# EAGLE board touch_glove (EAGLE 9.3.1)
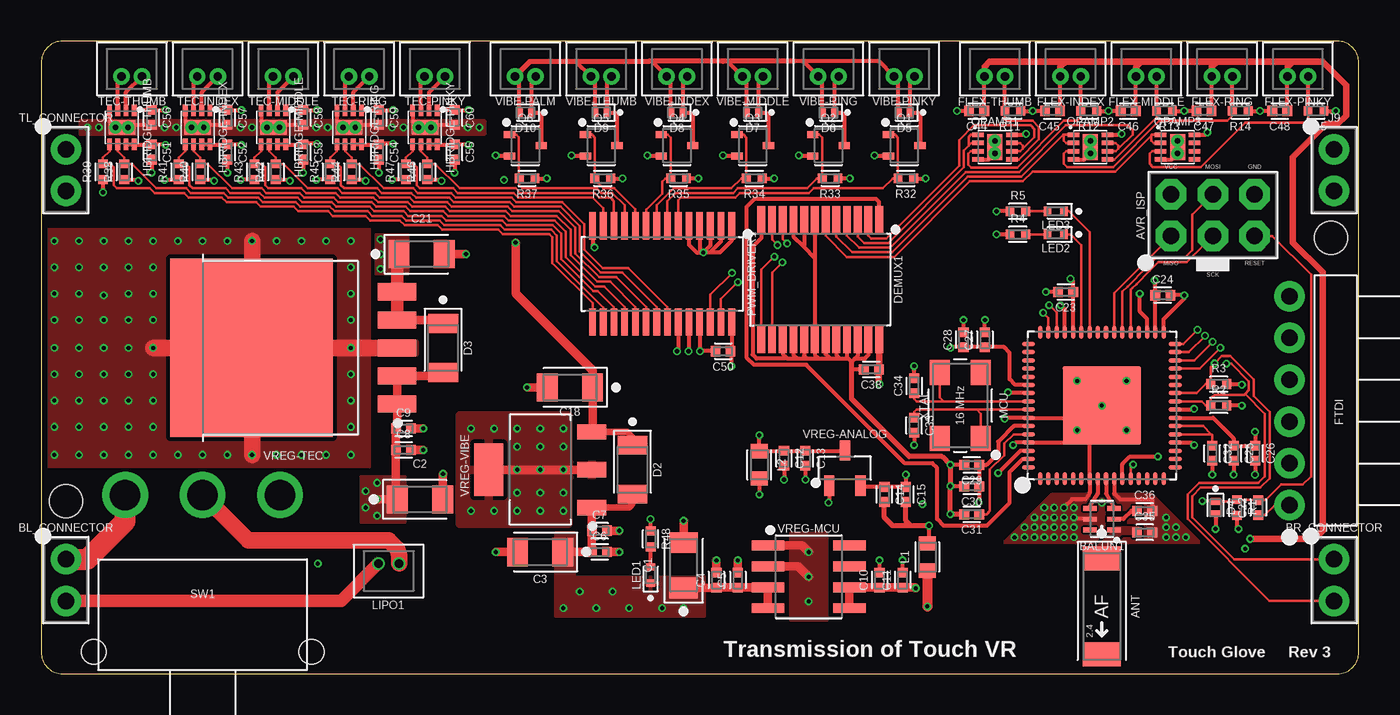
[diagram p5: board, top side]
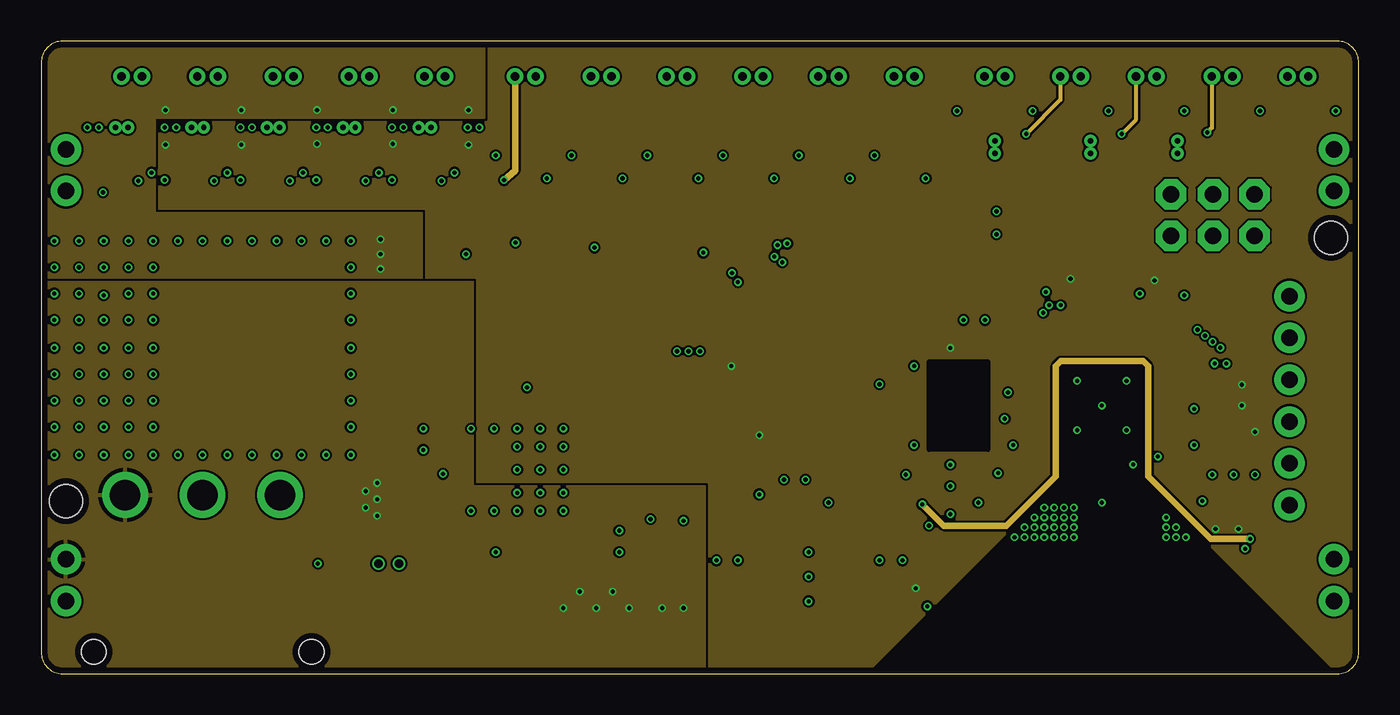
[diagram p6: board, inner layer Route2]
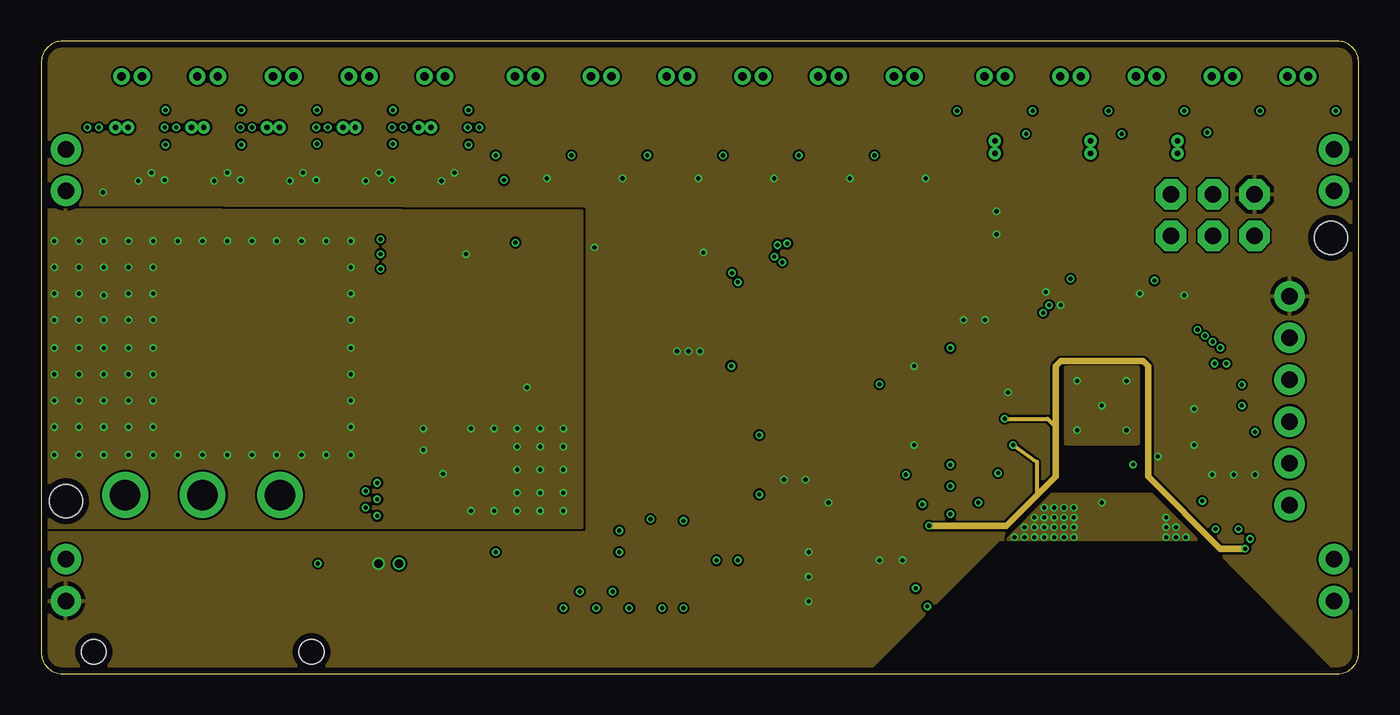
[diagram p7: board, inner layer Route15]
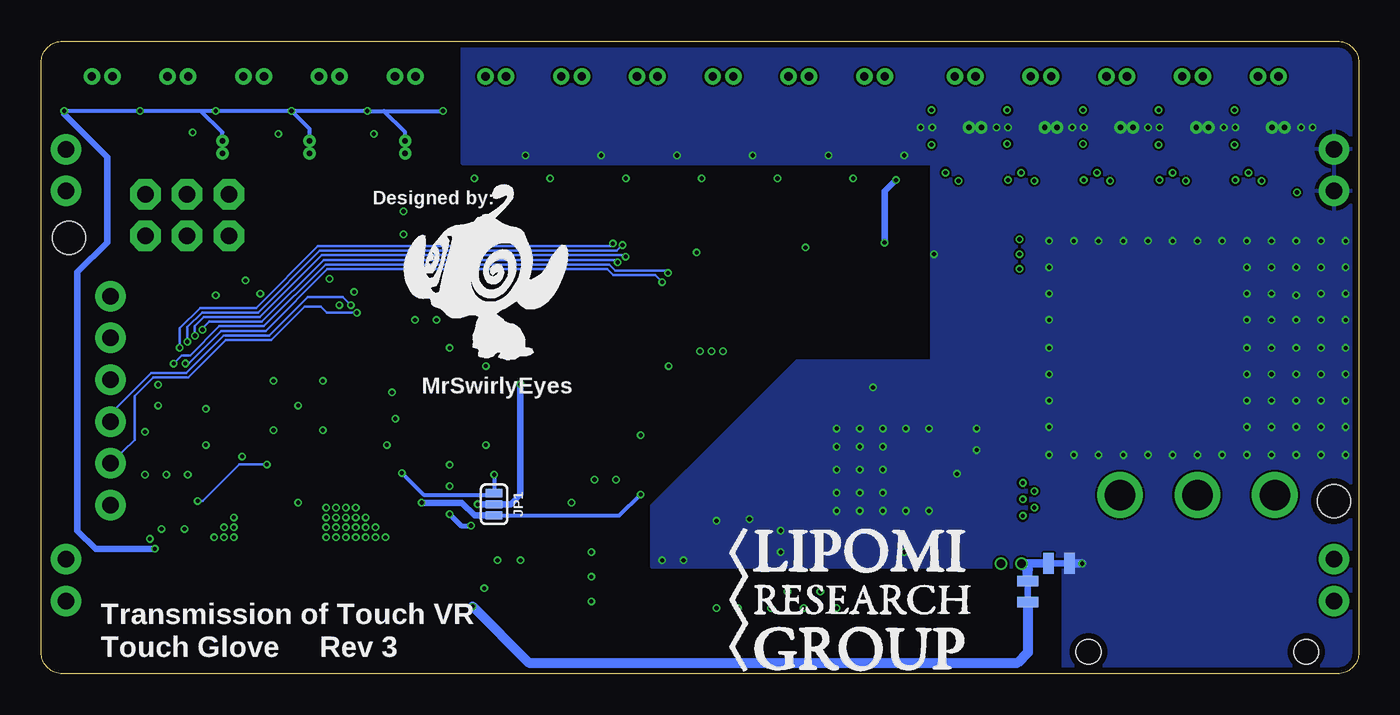
[diagram p8: board, bottom side, seen from below]

Size 80 x 38.44 mm. Coordinates in mm from the lower left corner, seen from the top.
Outline: 78.7,38.44 1.3,38.44 arc90 0,37.14 0,1.3 arc90 1.3,0 78.7,0 arc90 80,1.3 80,37.14 arc90 78.7,38.44
Copper layers (1*2*15*16): Top 0.035559375mm / dielectric 0.17018125mm / Route2 0.01778125mm / dielectric 47mil / Route15 0.01778125mm / dielectric 0.17018125mm / Bottom 0.035559375mm
Design rules "oshpark-4layer": minimum track width 5mil, minimum drill 10mil, track to track 5mil, track to pad 5mil, pad to pad 5mil, via to via 5mil, smd to smd 5mil, copper to edge 15mil, drill to drill 6mil, minimum pad ring 4mil, minimum via ring 4mil, stop-mask expansion 2.5mil, vias tented up to drill 0mil, thermal gap 10mil
Net classes: 1 vcc: width 0.254 mm, drill 0.254 mm, clearance 0.127 mm; 2 RFSIG: width 0.406 mm; 3 ASIG: width 0.254 mm; 4 DGND: width 0.254 mm; 5 NGND: width 0.254 mm
Holes 2 mm at 78.3,26.5 1.5,10.5

## Footprints (pad centres in the part's own frame; a part is rotated, then mirrored left to right if it is on the bottom)
ANTC6522X100 = smd 1.478 x 2.312: 1 -2.917,0 | smd 1.482 x 2.312: 2 2.915,0
HDRV6W64P254_2X3_762X508X838B = drill 1 pad 1.85 octagon: GND 2.54,1.27; MISO -2.54,-1.27; MOSI 0,1.27; RESET 2.54,-1.27; SCK 0,-1.27; VCC -2.54,1.27
RESCAXE65P200X125X95-6 = smd 0.818 x 0.289: 1 -0.73,0.65; 2 -0.73,0; 3 -0.73,-0.65; 4 0.73,-0.65; 5 0.73,0; 6 0.73,0.65
HDRV2W64P254_1X2_508X254X838B = drill 1 pad 1.85: 1 -1.27,0; 2 1.27,0
NET_BRIDGE = smd 0.635 x 1.27: P$1 -0.635,0; P$2 0.635,0
CAPCP3216X160 = smd 1.262 x 1.712: A -1.375,0; K 1.375,0
CAPC1005X55_SMD-0402 = smd 0.585 x 0.612: 1 -0.458,0; 2 0.458,0
SODFL3516X170 = smd 1.136 x 1.815: A -1.489,0; K 1.489,0
DFN100X60X55-2 = smd 0.41 x 0.55: A -0.37,0; K 0.37,0
SOP65P780X200-24 = smd 1.702 x 0.475: 1 -3.603,3.575; 2 -3.603,2.925; 3 -3.603,2.275; 4 -3.603,1.625; 5 -3.603,0.975; 6 -3.603,0.325; 7 -3.603,-0.325; 8 -3.603,-0.975; 9 -3.603,-1.625; 10 -3.603,-2.275; 11 -3.603,-2.925; 12 -3.603,-3.575; 13 3.603,-3.575; 14 3.603,-2.925; 15 3.603,-2.275; 16 3.603,-1.625; 17 3.603,-0.975; 18 3.603,-0.325; 19 3.603,0.325; 20 3.603,0.975; 21 3.603,1.625; 22 3.603,2.275; 23 3.603,2.925; 24 3.603,3.575
_MOLEX-0530470210_VERT_PITCH-1.25MM = drill 0.5 pad 1: 1 -0.625,0; 2 0.625,0
HDRRA6W64P254_1X6_1524X254X254B_FTDI = drill 1 pad 1.85: CTS 3.81,0; DTR -6.35,0; GND 6.35,0; RXI -3.81,0; TXO -1.27,0; VCC 1.27,0
WSON-8-PPAD = smd 0.7 x 0.28: 1 -1.035,0.75; 2 -1.035,0.25; 3 -1.035,-0.25; 4 -1.035,-0.75; 5 1.035,-0.75; 6 1.035,-0.25; 7 1.035,0.25; 8 1.035,0.75 | smd 0.9 x 1.6: GND 0,0 | drill 0.33 pad 0.75: P$1 0,-0.38; P$2 0,0.37
SMT-JUMPER_3_NO_SILK = smd 0.5 x 1: 1 -0.678,0; 2 0,0; 3 0.678,0
INDC1608X60-0603 = smd 0.859 x 1.015: 1 -0.828,0; 2 0.828,0
LEDC1005X40_LED-0402 = smd 0.454 x 0.554: A -0.5,0; K 0.5,0
BATTERY_MOLEX-0530470210_VERT_PITCH-1.25MM = drill 0.5: + -0.625,0; - 0.625,0
QFN50P900X900X90-64 = smd 0.812 x 0.282: 1 -4.45,3.75; 2 -4.45,3.25; 3 -4.45,2.75; 4 -4.45,2.25; 5 -4.45,1.75; 6 -4.45,1.25; 7 -4.45,0.75; 8 -4.45,0.25; 9 -4.45,-0.25; 10 -4.45,-0.75; 11 -4.45,-1.25; 12 -4.45,-1.75; 13 -4.45,-2.25; 14 -4.45,-2.75; 15 -4.45,-3.25; 16 -4.45,-3.75; 33 4.45,-3.75; 34 4.45,-3.25; 35 4.45,-2.75; 36 4.45,-2.25; 37 4.45,-1.75; 38 4.45,-1.25; 39 4.45,-0.75; 40 4.45,-0.25; 41 4.45,0.25; 42 4.45,0.75; 43 4.45,1.25; 44 4.45,1.75; 45 4.45,2.25; 46 4.45,2.75; 47 4.45,3.25; 48 4.45,3.75 | smd 0.282 x 0.812: 17 -3.75,-4.45; 18 -3.25,-4.45; 19 -2.75,-4.45; 20 -2.25,-4.45; 21 -1.75,-4.45; 22 -1.25,-4.45; 23 -0.75,-4.45; 24 -0.25,-4.45; 25 0.25,-4.45; 26 0.75,-4.45; 27 1.25,-4.45; 28 1.75,-4.45; 29 2.25,-4.45; 30 2.75,-4.45; 31 3.25,-4.45; 32 3.75,-4.45; 49 3.75,4.45; 50 3.25,4.45; 51 2.75,4.45; 52 2.25,4.45; 53 1.75,4.45; 54 1.25,4.45; 55 0.75,4.45; 56 0.25,4.45; 57 -0.25,4.45; 58 -0.75,4.45; 59 -1.25,4.45; 60 -1.75,4.45; 61 -2.25,4.45; 62 -2.75,4.45; 63 -3.25,4.45; 64 -3.75,4.45 | smd 4.75 x 4.75: EP 0,0 | drill 0.254: P$1 -1.5,1.5; P$2 1.5,1.5; P$3 1.5,-1.5; P$4 -1.5,-1.5; P$5 0,0
SOP65P650X110-28 = smd 1.659 x 0.407: 1 -2.926,4.225; 2 -2.926,3.575; 3 -2.926,2.925; 4 -2.926,2.275; 5 -2.926,1.625; 6 -2.926,0.975; 7 -2.926,0.325; 8 -2.926,-0.325; 9 -2.926,-0.975; 10 -2.926,-1.625; 11 -2.926,-2.275; 12 -2.926,-2.925; 13 -2.926,-3.575; 14 -2.926,-4.225; 15 2.926,-4.225; 16 2.926,-3.575; 17 2.926,-2.925; 18 2.926,-2.275; 19 2.926,-1.625; 20 2.926,-0.975; 21 2.926,-0.325; 22 2.926,0.325; 23 2.926,0.975; 24 2.926,1.625; 25 2.926,2.275; 26 2.926,2.925; 27 2.926,3.575; 28 2.926,4.225
SOTFL65P209X90-3 = smd 0.685 x 0.437: 1 -0.958,0.65; 2 -0.958,-0.65; 3 0.958,0
RESC1005X35_SMD-0402 = smd 0.535 x 0.6: 1 -0.482,0; 2 0.482,0
SW_SLIDE_SPDT_RA_PTH_12.7L-9.5W = drill 1.85: P 0,7.265; S1 -4.7,7.265; S2 4.7,7.265 | hole 1.5: 6.605,-2.265; -6.605,-2.265
SOT95P237X112-3_SOT-23-3 = smd 1.224 x 0.625: 1 -1.064,0.95; 2 -1.064,-0.95; 3 1.064,0
SOIC127P600X265-8 = smd 1.968 x 0.599: 1 -2.473,1.905; 2 -2.473,0.635; 3 -2.473,-0.635; 4 -2.473,-1.905; 5 2.473,-1.905; 6 2.473,-0.635; 7 2.473,0.635; 8 2.473,1.905
TO170P1363X457-6 = smd 2.333 x 1.048: 1 -6.311,3.404; 2 -6.311,1.702; 3 -6.311,0; 4 -6.311,-1.702; 5 -6.311,-3.404 | smd 9.885 x 10.84: TAB 2.535,0
SOT229P700X180-4 = smd 1.76 x 0.932: 1 -3.125,2.3; 2 -3.125,0; 3 -3.125,-2.3 | smd 1.76 x 3.189: TAB 3.125,0
OSCCC500X320X110_CRYSTAL = smd 1.512 x 1.212: 1 -2,-1.25; 2 2,-1.25; 3 2,1.25; 4 -2,1.25

## Placement (x,y rotation side)
ANT  2.45GHz  [ANTC6522X100]  64.4,4.1 270 top
AVR_ISP  AVR ISP  [HDRV6W64P254_2X3_762X508X838B]  71.14,27.87 0 top
BALUN1  50/100  [RESCAXE65P200X125X95-6]  64.4,9.4 180 top
BL_CONNECTOR  PTH VERT MALE  [HDRV2W64P254_1X2_508X254X838B]  1.5,5.7 270 top
BR_ANALOG  NET_BRIDGE  [NET_BRIDGE]  20.1,5 270 bottom
BR_CONNECTOR  PTH VERT MALE  [HDRV2W64P254_1X2_508X254X838B]  78.5,5.7 270 top
BR_NOISE  NET_BRIDGE  [NET_BRIDGE]  18.2,6.7 180 bottom
C1  100uF/10V  [CAPCP3216X160]  39,6.6 90 top
C2  100uF/10V  [CAPCP3216X160]  23,10.6 0 top
C3  100uF/10V  [CAPCP3216X160]  30.3,7.4 180 top
C4  10uF/6.3V  [CAPC1005X55_SMD-0402]  41,5.7 90 top
C5  0.1uF/50V  [CAPC1005X55_SMD-0402]  42.3,5.7 90 top
C6  10uF/6.3V  [CAPC1005X55_SMD-0402]  33.9,7.4 0 top
C7  0.1uF/50V  [CAPC1005X55_SMD-0402]  33.9,8.7 0 top
C8  10uF/6.3V  [CAPC1005X55_SMD-0402]  22,13.6 0 top
C9  0.1uF/50V  [CAPC1005X55_SMD-0402]  22,14.9 0 top
C10  0.1uF/50V  [CAPC1005X55_SMD-0402]  50.9,5.7 90 top
C11  10uF/6.3V  [CAPC1005X55_SMD-0402]  52.3,5.7 90 top
C12  10uF/6.3V  [CAPC1005X55_SMD-0402]  45.1,13.1 270 top
C13  0.1uF/50V  [CAPC1005X55_SMD-0402]  46.4,13.1 270 top
C14  0.1uF/50V  [CAPC1005X55_SMD-0402]  51.2,10.9 270 top
C15  10uF/6.3V  [CAPC1005X55_SMD-0402]  52.5,10.9 270 top
C18  100uF/10V  [CAPCP3216X160]  32.1,17.4 180 top
C21  100uF/10V  [CAPCP3216X160]  23.1,25.5 0 top
C22  0.1uF/50V  [CAPC1005X55_SMD-0402]  73.9,10.1 90 top
C23  0.1uF/50V  [CAPC1005X55_SMD-0402]  62.2,23.2 180 top
C24  1uF/25V  [CAPC1005X55_SMD-0402]  68.1,23 0 top
C25  0.1uF/50V  [CAPC1005X55_SMD-0402]  72.4,13.4 270 top
C26  1uF/25V  [CAPC1005X55_SMD-0402]  73.7,13.4 270 top
C27  0.1uF/50V  [CAPC1005X55_SMD-0402]  57.3,20.3 90 top
C28  1uF/25V  [CAPC1005X55_SMD-0402]  56,20.3 90 top
C29  1uF/25V  [CAPC1005X55_SMD-0402]  56.5,12.7 180 top
C30  0.1uF/50V  [CAPC1005X55_SMD-0402]  56.5,11.4 180 top
C31  1uF/25V  [CAPC1005X55_SMD-0402]  56.5,9.7 180 top
C32  1uF/25V  [CAPC1005X55_SMD-0402]  71.1,13.4 270 top
C33  12pF/100V  [CAPC1005X55_SMD-0402]  53,15.1 270 top
C34  12pF/100V  [CAPC1005X55_SMD-0402]  53,17.5 90 top
C35  0.75pF/50V  [CAPC1005X55_SMD-0402]  67,8.6 0 top
C36  22pF/100V/0402  [CAPC1005X55_SMD-0402]  67,9.9 0 top
C38  0.1uF/50V  [CAPC1005X55_SMD-0402]  50.4,18.5 180 top
C44  0.1uF/50V  [CAPC1005X55_SMD-0402]  56.8,34.2 180 top
C45  0.1uF/50V  [CAPC1005X55_SMD-0402]  61.4,34.2 180 top
C46  0.1uF/50V  [CAPC1005X55_SMD-0402]  66,34.2 180 top
C47  0.1uF/50V  [CAPC1005X55_SMD-0402]  70.6,34.2 180 top
C48  0.1uF/50V  [CAPC1005X55_SMD-0402]  75.2,34.2 180 top
C50  0.1uF/50V  [CAPC1005X55_SMD-0402]  41.4,19.6 180 top
C51  0.1uF/50V  [CAPC1005X55_SMD-0402]  6.7,31.7 270 top
C52  0.1uF/50V  [CAPC1005X55_SMD-0402]  11.3,31.7 270 top
C53  0.1uF/50V  [CAPC1005X55_SMD-0402]  15.9,31.7 270 top
C54  0.1uF/50V  [CAPC1005X55_SMD-0402]  20.5,31.7 270 top
C55  0.1uF/50V  [CAPC1005X55_SMD-0402]  25.1,31.7 270 top
C56  0.1uF/50V  [CAPC1005X55_SMD-0402]  6.7,33.8 270 top
C57  0.1uF/50V  [CAPC1005X55_SMD-0402]  11.3,33.8 270 top
C58  0.1uF/50V  [CAPC1005X55_SMD-0402]  15.9,33.8 270 top
C59  0.1uF/50V  [CAPC1005X55_SMD-0402]  20.5,33.8 270 top
C60  0.1uF/50V  [CAPC1005X55_SMD-0402]  25.1,33.8 270 top
D2  1A/50V  [SODFL3516X170]  35.9,12.4 270 top
D3  1A/50V  [SODFL3516X170]  24.4,19.8 270 top
D4  150mA/75V  [DFN100X60X55-2]  71.3,10.1 270 top
D5  150mA/75V  [DFN100X60X55-2]  52.4,34.1 180 top
D6  150mA/75V  [DFN100X60X55-2]  47.8,34.1 180 top
D7  150mA/75V  [DFN100X60X55-2]  43.2,34.1 180 top
D8  150mA/75V  [DFN100X60X55-2]  38.6,34.1 180 top
D9  150mA/75V  [DFN100X60X55-2]  34,34.1 180 top
D10  150mA/75V  [DFN100X60X55-2]  29.4,34.1 180 top
DEMUX1  CH16_MUX-DEMUX  [SOP65P780X200-24]  47.3,23.95 270 top
FLEX-INDEX  10K  [_MOLEX-0530470210_VERT_PITCH-1.25MM]  62.5,36.3 0 top
FLEX-MIDDLE  10K  [_MOLEX-0530470210_VERT_PITCH-1.25MM]  67.1,36.3 0 top
FLEX-PINKY  10K  [_MOLEX-0530470210_VERT_PITCH-1.25MM]  76.3,36.3 0 top
FLEX-RING  10K  [_MOLEX-0530470210_VERT_PITCH-1.25MM]  71.7,36.3 0 top
FLEX-THUMB  10K  [_MOLEX-0530470210_VERT_PITCH-1.25MM]  57.9,36.3 0 top
FTDI  PTH RA VERT MALE  [HDRRA6W64P254_1X6_1524X254X254B_FTDI]  75.8,16.6 90 top
HBRIDGE-INDEX  DRV8837C 1A  [WSON-8-PPAD]  9.5,33.2 270 top
HBRIDGE-MIDDLE  DRV8837C 1A  [WSON-8-PPAD]  14.1,33.2 270 top
HBRIDGE-PINKY  DRV8837C 1A  [WSON-8-PPAD]  23.3,33.2 270 top
HBRIDGE-RING  DRV8837C 1A  [WSON-8-PPAD]  18.7,33.2 270 top
HBRIDGE-THUMB  DRV8837C 1A  [WSON-8-PPAD]  4.9,33.2 270 top
J9  PTH VERT MALE  [HDRV2W64P254_1X2_508X254X838B]  78.5,30.6 270 top
JP1  JUMPER_SMD_3-PAD_NO_SILK  [SMT-JUMPER_3_NO_SILK]  52.5,10.3 270 bottom
L1  10uH/380mA  [INDC1608X60-0603]  53.8,7.1 90 top
L2  10uH/380mA  [INDC1608X60-0603]  43.6,12.7 270 top
LED1  BLUE  [LEDC1005X40_LED-0402]  37,6 90 top
LED2  GREEN  [LEDC1005X40_LED-0402]  61.6,26.7 180 top
LED3  RED  [LEDC1005X40_LED-0402]  61.6,28.1 180 top
LIPO1  7.4V  [BATTERY_MOLEX-0530470210_VERT_PITCH-1.25MM]  21.1,6.7 180 top
MCU  ATMEGA128RFA1  [QFN50P900X900X90-64]  64.4,16.3 90 top
OPAMP1  LM358  [WSON-8-PPAD]  57.9,32 0 top
OPAMP2  LM358  [WSON-8-PPAD]  63.7,32 0 top
OPAMP3  LM358  [WSON-8-PPAD]  69,32 0 top
PWM_DRIVER1  PCA9685  [SOP65P650X110-28]  37.7,24.3 270 top
Q1  MCH3474 4A/30V  [SOTFL65P209X90-3]  52.4,32.1 0 top
Q2  MCH3474 4A/30V  [SOTFL65P209X90-3]  47.8,32.1 0 top
Q3  MCH3474 4A/30V  [SOTFL65P209X90-3]  43.2,32.1 0 top
Q4  MCH3474 4A/30V  [SOTFL65P209X90-3]  38.6,32.1 0 top
Q5  MCH3474 4A/30V  [SOTFL65P209X90-3]  34,32.1 0 top
Q6  MCH3474 4A/30V  [SOTFL65P209X90-3]  29.4,32.1 0 top
R1  10K  [RESC1005X35_SMD-0402]  72.6,10.1 270 top
R2  4.7K  [RESC1005X35_SMD-0402]  71.5,16.3 0 top
R3  4.7K  [RESC1005X35_SMD-0402]  71.5,17.6 0 top
R4  1K  [RESC1005X35_SMD-0402]  59.3,26.7 0 top
R5  1K  [RESC1005X35_SMD-0402]  59.3,28.1 0 top
R11  10K  [RESC1005X35_SMD-0402]  59,34.2 180 top
R12  10K  [RESC1005X35_SMD-0402]  63.6,34.2 180 top
R13  10K  [RESC1005X35_SMD-0402]  68.2,34.2 180 top
R14  10K  [RESC1005X35_SMD-0402]  72.8,34.2 180 top
R15  10K  [RESC1005X35_SMD-0402]  77.4,34.2 180 top
R32  10K  [RESC1005X35_SMD-0402]  52.5,30.1 180 top
R33  10K  [RESC1005X35_SMD-0402]  47.9,30.1 180 top
R34  10K  [RESC1005X35_SMD-0402]  43.3,30.1 180 top
R35  10K  [RESC1005X35_SMD-0402]  38.7,30.1 180 top
R36  10K  [RESC1005X35_SMD-0402]  34.1,30.1 180 top
R37  10K  [RESC1005X35_SMD-0402]  29.5,30.1 180 top
R38  10K  [RESC1005X35_SMD-0402]  5.05,30.5 90 top
R39  10K  [RESC1005X35_SMD-0402]  3.75,30.5 90 top
R40  10K  [RESC1005X35_SMD-0402]  9.65,30.5 90 top
R41  10K  [RESC1005X35_SMD-0402]  8.35,30.5 90 top
R42  10K  [RESC1005X35_SMD-0402]  14.25,30.5 90 top
R43  10K  [RESC1005X35_SMD-0402]  12.95,30.5 90 top
R44  10K  [RESC1005X35_SMD-0402]  18.85,30.5 90 top
R45  10K  [RESC1005X35_SMD-0402]  17.55,30.5 90 top
R46  10K  [RESC1005X35_SMD-0402]  23.45,30.5 90 top
R47  10K  [RESC1005X35_SMD-0402]  22.15,30.5 90 top
R48  10K  [RESC1005X35_SMD-0402]  37,8.2 270 top
SW1  4A/28V  [SW_SLIDE_SPDT_RA_PTH_12.7L-9.5W]  9.8,3.6 0 top
TEC-INDEX  PELTIER  [_MOLEX-0530470210_VERT_PITCH-1.25MM]  10.1,36.3 0 top
TEC-MIDDLE  PELTIER  [_MOLEX-0530470210_VERT_PITCH-1.25MM]  14.7,36.3 0 top
TEC-PINKY  PELTIER  [_MOLEX-0530470210_VERT_PITCH-1.25MM]  23.9,36.3 0 top
TEC-RING  PELTIER  [_MOLEX-0530470210_VERT_PITCH-1.25MM]  19.3,36.3 0 top
TEC-THUMB  PELTIER  [_MOLEX-0530470210_VERT_PITCH-1.25MM]  5.5,36.3 0 top
TL_CONNECTOR  PTH VERT MALE  [HDRV2W64P254_1X2_508X254X838B]  1.5,30.6 270 top
U$1  [LRG-LOGO-2]  30.9,4.5 0 bottom
U$2  [MRSWIRLYEYES-LOGO]  53,24.4 0 bottom
VIBE-INDEX  Molex VERT 1.25mm pitch  [_MOLEX-0530470210_VERT_PITCH-1.25MM]  38.6,36.3 0 top
VIBE-MIDDLE  Molex VERT 1.25mm pitch  [_MOLEX-0530470210_VERT_PITCH-1.25MM]  43.2,36.3 0 top
VIBE-PALM  Molex VERT 1.25mm pitch  [_MOLEX-0530470210_VERT_PITCH-1.25MM]  29.4,36.3 0 top
VIBE-PINKY  Molex VERT 1.25mm pitch  [_MOLEX-0530470210_VERT_PITCH-1.25MM]  52.4,36.3 0 top
VIBE-RING  Molex VERT 1.25mm pitch  [_MOLEX-0530470210_VERT_PITCH-1.25MM]  47.8,36.3 0 top
VIBE-THUMB  Molex VERT 1.25mm pitch  [_MOLEX-0530470210_VERT_PITCH-1.25MM]  34,36.3 0 top
VREG-ANALOG  MCP1700-1802 1.8V/200mA  [SOT95P237X112-3_SOT-23-3]  48.8,12.5 90 top
VREG-MCU  TPS76833QDR 1A/3.3V  [SOIC127P600X265-8]  46.6,5.9 0 top
VREG-TEC  3A/1.8V  [TO170P1363X457-6]  15.3,19.8 180 top
VREG-VIBE  TL1963A-33 1.5A/3.3V  [SOT229P700X180-4]  30.3,12.4 180 top
XTAL  16 MHz  [OSCCC500X320X110_CRYSTAL]  55.8,16.3 90 top

## Tracks (layer width: path | path; a pad name or v marks a point on that pad's centre or on a via)
1.8V  (via drill 0.25)
  Top 0.152: C60.1 24.98,34.23 | 14.87,34.26 HBRIDGE-MIDDLE.1 | 10.27,34.26 HBRIDGE-INDEX.1 | 5.67,34.26 HBRIDGE-THUMB.1 | 24.19,21.5 D3.A
  Top 0.254: 24.98,34.23 HBRIDGE-PINKY.1 | 14.87,34.26 C58.1 v16.74,34.26 v16.75,34.25 | 10.27,34.26 C57.1 v12.14,34.26 v12.15,34.25 | 5.67,34.26 C56.1 v7.54,34.26 v7.55,34.25 | v21.35,34.25 v21.34,34.26 C59.1 20.48,34.23 HBRIDGE-RING.1 | C60.1 v25.94,34.26 v25.95,34.25
  Top 0.508: VREG-TEC.4 24.19,21.5 | 21.61,25.39 C21.A
  Top 0.762: VREG-TEC.4 VREG-TEC.5 21.61,25.39
  other vias: 20.6,26.4 20.6,25.5 20.6,24.6
  pour Route2 (rank 5): 26.9,38.4 0,38.4 0,24 23.1,24 23.1,28 6.9,28 6.9,33.8 26.9,33.8
  pour Top: 22.3,24.3 20.3,24.3 20.3,26.7 22.3,26.7
3.3V  (via drill 0.25)
  Top 0.254: D5.K 52.03,36.05 VIBE-PINKY.1 50.87,37.21 46.27,37.21 | D6.K 47.43,36.05 VIBE-RING.1 46.27,37.21 | D7.K 42.83,36.05 VIBE-MIDDLE.1 41.67,37.21 41.4,37.21 | D8.K 38.23,36.05 VIBE-INDEX.1 37.07,37.21 36.9,37.21 | D9.K 33.63,36.05 VIBE-THUMB.1 32.5,37.17 32.5,37.21 | D10.K 29.03,36.05 VIBE-PALM.1 | 46.27,37.21 45.67,37.21
  Top 0.305: 45.67,37.21 41.4,37.21 36.9,37.21 32.5,37.21 29.68,37.21 VIBE-PALM.1
  Top 0.406: VREG-VIBE.3 35.59,14.7 35.9,14.39 D2.A
  Top 0.508: VREG-VIBE.3 33.48,14.75 C18.A 33.48,18.43 28.8,23.1 v28.8,26.2
  Route2 0.406: VIBE-PALM.1 28.77,30.57 v28.1,30
  Bottom 0.406: v28.8,26.2 28.77,26.23 28.77,29.32 v28.1,30
+
  Top 1.016: LIPO1.+ 21.73,7.19 21.62,7.58 21.1,8.1 12.57,8.1 SW1.P
A1.8V  (via drill 0.25)
  Top 0.254: VREG-ANALOG.2 49.87,11.36 C14.1 C15.1 v52.5,12.1 | MCU.62 59.45,13.55 v58.1,12.2
  Bottom 0.254: v52.5,12.1 JP1.1 52.59,10.88 56.78,10.88 v58.1,12.2
A3.3V  (via drill 0.25)
  Top 0.254: MCU.59 59.05,15.05 58.1,14.1 58.1,13.4 57.4,12.7 C29.1 C30.1 56.96,10.46 v56.9,10.4 | L2.2 v43.6,10.9
  Bottom 0.254: JP1.3 44.91,9.62 v43.6,10.9
  Bottom 0.406: v56.9,10.4 54.45,10.4 53.67,9.62 JP1.3
AGND  (via drill 0.25)
  Top 0.254: C48.2 v74,34.2 R14.1 | C47.2 v69.4,34.2 R13.1 | R12.1 v64.8,34.2 C46.2 | R11.1 v60.2,34.2 C45.2 | C30.2 v55.2,11.4 | C29.2 v55.2,12.7 | v59.01,13.9 59.16,14.05 MCU.61 62.15,14.05 MCU.P$1 | DEMUX1.15 45.02,19.43 45.3,19.15 | 45.3,19.15 45.9,19.15 | 46.5,19.15 47.2,19.15 | 47.2,19.15 47.9,19.15 | 47.9,19.15 48.5,19.15 | 47.2,19.15 46.98,19.38 DEMUX1.18 46.98,25.27 | DEMUX1.19 47.62,19.43 47.9,19.15 | DEMUX1.20 48.27,19.38 48.5,19.15 | R15.1 v78.6,34.2 | 48.5,19.15 49,19.15 | 49,19.15 49.2,18.95 49.38,19.12 | DEMUX1.21 48.92,19.23 49,19.15 | DEMUX1.17 46.33,19.32 46.5,19.15 | DEMUX1.16 45.67,19.38 45.9,19.15 | v53.9,9 53.9,8.03 L1.2 | DEMUX1.12 43.73,26.48 43.2,25.95 43.2,19.39 43.44,19.15 45.3,19.15 | BALUN1.5 62.7,9.4 v62.7,9.5 | MCU.P$1 63.65,14.05 MCU.7 63.65,11.01 63.4,10.6 62.6,10.6 v62.1,10.1 | MCU.P$1 62.15,15.55 MCU.58 58.55,15.55 v58.5,15.5 | C44.2 v55.6,34.2 | MCU.10 65.15,10.95 65.5,10.6 67.46,10.6 C36.2 | OPAMP3.4 68.63,31.25 OPAMP3.P$1 OPAMP3.GND OPAMP3.P$2 | OPAMP1.4 57.53,31.25 OPAMP1.P$1 OPAMP1.GND OPAMP1.P$2 | OPAMP2.4 63.33,31.25 OPAMP2.P$1 OPAMP2.GND OPAMP2.P$2 | 45.9,19.15 46.5,19.15 | DEMUX1.9 45.67,26.57 46.27,25.98 | 46.27,25.98 46.98,25.27 | DEMUX1.7 46.98,25.27 | DEMUX1.8 46.33,26.02 46.27,25.98 | DEMUX1.22 49.58,19.32 49.38,19.12 | DEMUX1.23 50.23,19.38 49.98,19.12 49.38,19.12 | C38.2 49.3,18.5 49.2,18.4
  Top 0.305: 49.2,18.95 49.2,18.4 49.2,16.7 52.7,13.2 54.7,13.2 v55.2,12.7 v55.2,11.4 v55.2,9.7 C31.2 | v53.9,9 52.8,9 | 52.8,9 52.5,9.3 C15.2 | 52.8,9 51.7,9 51.2,9.5 C14.2
  Route15 0.254: v59.01,13.9 60.45,12.88 60.45,10.85 | 61.6,15 61.1,15.5 v58.5,15.5
  Route15 0.41: v53.9,9 58.6,9 60.45,10.85 61.6,12 61.6,15 61.6,18.7 61.9,19 66.9,19 67.2,18.7 67.2,12 71.6,7.6 v73.1,7.6
  Bottom 0.254: 59.2,34.2 v60.2,34.2 v64.8,34.2 | 59.2,34.2 v55.6,34.2 | v64.8,34.2 v69.4,34.2 70.3,34.2 | 70.3,34.2 v74,34.2 v78.6,34.2 | OPAMP3.P$2 69,32.9 70.3,34.2 | OPAMP2.P$2 63.7,33.1 v64.8,34.2 | 59.2,34.2 57.9,32.9 OPAMP1.P$2
  Bottom 0.305: v55.2,9.7 54.5,9 v53.9,9
  Bottom 0.406: v73.1,7.6 76.7,7.6 77.8,8.7 77.8,24.4 76,26.2 76,31.4 78.6,34 v78.6,34.2
  other vias: 62.7,8.3 62.1,8.3 62.7,8.9 61.5,8.3 60.9,8.3 60.3,8.3 59.7,8.3 62.1,8.9 61.5,8.9 60.9,8.9 60.3,8.9 62.1,9.5 61.5,9.5 60.9,9.5 62.7,10.1 61.5,10.1 64.4,10.4 68.3,8.3 68.9,8.3 68.3,8.9 59.1,8.3 59.7,8.9 60.3,9.5 60.9,10.1 69.5,8.3 68.9,8.9 68.3,9.5
  pour Route15: 62.2,14 66.6,14 66.6,18.6 62.2,18.6
  pour Route15: 58.5,8 61.4,10.9 67.4,10.9 70.3,8
  pour Top (rank 2): 58.5,8 61.4,10.9 67.4,10.9 70.3,8
FLEX-INDEX
  Top 0.152: OPAMP1.1 56.45,32.75 56.31,32.61 56.31,32.09 | DEMUX1.3 49.58,26.57 49.98,26.17 51.42,26.17 56.02,30.77 56.02,31.8 56.31,32.09 | OPAMP1.2 56.47,32.25 56.31,32.09
FLEX-MIDDLE
  Top 0.152: OPAMP2.7 65.25,32.25 65.4,32.1 65.4,31.9 | 65.4,31.9 65.25,31.75 OPAMP2.6 | 65.4,31.9 66.26,32.76 66.26,33.04 65.98,33.32 62.22,33.32 59.38,30.48 56.14,30.48 51.55,25.89 49.66,25.89 48.92,26.62 DEMUX1.4
FLEX-PINKY
  Top 0.152: DEMUX1.6 47.62,26.62 48.92,25.33 51.8,25.33 56.39,29.92 59.61,29.92 60.21,30.52 65.21,30.52 67.39,32.7 | OPAMP3.2 67.55,32.25 67.39,32.41 67.39,32.7 | OPAMP3.1 67.44,32.75 67.39,32.7
FLEX-RING
  Top 0.152: DEMUX1.5 48.27,26.57 49.24,25.61 51.66,25.61 56.25,30.2 59.49,30.2 62.04,32.75 62.1,32.75 | OPAMP2.2 62.25,32.25 62.1,32.4 62.1,32.75 | OPAMP2.1 62.1,32.75
FLEX-THUMB
  Top 0.152: OPAMP1.7 59.45,32.25 59.6,32.1 59.6,31.9 | 59.6,31.9 59.45,31.75 OPAMP1.6 | 59.6,31.9 60.3,32.6 60.3,33.1 60.08,33.32 56.62,33.32 55.74,32.44 55.74,30.89 51.3,26.45 50.4,26.45 50.23,26.62 DEMUX1.2
GND  (via drill 0.25)
  Top 0.254: C34.2 v53,18.7 | C33.2 v53,13.9 | C28.2 v56,21.5 | C27.2 v57.3,21.5 | C10.2 v50.9,6.9 | C11.2 v52.3,6.9 | MCU.11 65.65,12.75 66.1,13.2 v67.8,13.2 | C50.2 v40,19.6 39.98,19.62 PWM_DRIVER1.25 | PWM_DRIVER1.23 38.67,19.68 v38.6,19.6 | PWM_DRIVER1.24 39.33,19.62 v39.3,19.6 | PWM_DRIVER1.3 40.62,26.02 v40.2,25.6 | PWM_DRIVER1.2 41.27,26.27 40.6,25.6 | 40.6,25.6 v40.2,25.6 | PWM_DRIVER1.1 41.92,26.32 41.2,25.6 40.6,25.6 | PWM_DRIVER1.4 39.98,25.6 | 39.98,25.6 v40.2,25.6 | PWM_DRIVER1.5 39.33,26.07 39.8,25.6 39.98,25.6 | R32.1 v53.7,30.1 | C55.2 v25.1,30.45 | C54.2 v20.5,30.45 | C53.2 v15.9,30.45 | C52.2 v11.3,30.45 | C51.2 v6.7,30.45 | PWM_DRIVER1.14 33.48,26.02 v33.6,25.9 | C32.2 v71.1,12.1 | C25.2 v72.4,12.1 | C26.2 v73.7,12.1 | C23.2 v61,23.2 | R4.1 v58,26.7 | R5.1 v58,28.1 | C24.2 v69.4,23 69.4,22.8 68.15,21.55 MCU.33 | MCU.45 62.15,22.15 v61.9,22.4 | MCU.35 67.15,21.55 66.7,22 v66.7,23.1 | MCU.55 58.75,17.05 v58.7,17.1 | MCU.20 69.85,14.05 v70,13.9 | MCU.24 69.95,16.05 v70,16.1 | R37.1 v30.7,30.1 | R36.1 v35.3,30.1 | R34.1 v44.5,30.1 | R46.1 24.23,30.02 v24.3,29.95 | R47.1 21.32,30.02 v21.3,30 | R44.1 19.58,30.02 v19.7,29.95 | R45.1 16.72,30.02 v16.7,30 | R42.1 15.03,30.02 v15.1,29.95 | R43.1 12.12,30.02 v12.1,30 | R41.1 8.33,30 v7.5,30 | R39.1 v3.75,29.25 | R38.1 5.83,30.02 v5.9,29.95 | v49.1,30.1 R33.1 | v39.9,30.1 R35.1 | R40.1 10.43,30.02 v10.5,29.95 | C13.2 v46.4,11.8 | C12.2 v45.1,11.8 | VREG-ANALOG.1 47.85,10.45 v47.8,10.4
  Top 0.508: v46.6,5.9 45.97,6.54 VREG-MCU.2 | v46.6,7.4 46.2,7.8 VREG-MCU.1
  Top 0.762: BL_CONNECTOR.2 18.2,4.43 LIPO1.-
  Bottom 0.508: BR_NOISE.P$2 LIPO1.-
  Bottom 0.61: BR_ANALOG.P$1 20.1,6.33 LIPO1.-
  other vias: 46.6,4.4
  pour Route15 (rank 6): 0,38.44 0,0 80,0 80,38.44
  pour Top: 45.5,3.3 47.7,3.3 47.7,8.5 45.5,8.5
LED_RX
  Top 0.152: LED3.A 62.4,28.1 63.65,26.85 MCU.42
LED_TX
  Top 0.152: LED2.A 62.5,26.7 63.15,26.05 63.15,22.81 MCU.43
MISO
  Top 0.152: AVR_ISP.MISO 65.15,23.15 MCU.39
MOSI
  Top 0.152: MCU.38 65.65,23.23 65.96,23.54 67.11,24.7 67.71,25.3 | 67.71,25.3 | 67.71,25.3 69.44,25.3 69.9,25.75 69.9,27.9 AVR_ISP.MOSI
N$1
  Top 0.254: HBRIDGE-THUMB.3 4.65,36.08 TEC-THUMB.1
N$2
  Top 0.254: VIBE-INDEX.2 38.97,36.05 D8.A 39.4,34.1 39.56,33.94 Q4.3
N$3
  Top 0.254: VIBE-THUMB.2 34.37,36.05 D9.A 34.8,34.1 34.96,33.94 Q5.3
N$4
  Top 0.254: VIBE-MIDDLE.2 43.57,36.05 D7.A 44,34.1 44.16,33.94 Q3.3
N$5
  Top 0.254: HBRIDGE-THUMB.2 5.15,35.33 TEC-THUMB.2
N$6
  Top 0.254: HBRIDGE-INDEX.2 9.75,35.33 TEC-INDEX.2
N$11
  Top 0.254: HBRIDGE-INDEX.3 9.25,36.08 TEC-INDEX.1
N$12
  Top 0.254: HBRIDGE-MIDDLE.3 13.85,36.08 TEC-MIDDLE.1
N$15
  Top 0.254: VIBE-RING.2 48.17,36.05 D6.A 48.6,34.1 48.76,33.94 Q2.3
N$16
  Top 0.254: HBRIDGE-MIDDLE.2 14.35,35.33 TEC-MIDDLE.2
N$17
  Top 0.254: VIBE-PINKY.2 52.77,36.05 D5.A 53.2,34.1 53.36,33.94 Q1.3
N$18
  Top 0.254: HBRIDGE-RING.3 18.45,36.08 TEC-RING.1
N$23
  Top 0.254: HBRIDGE-RING.2 18.95,35.33 TEC-RING.2
N$24
  Top 0.254: HBRIDGE-PINKY.3 23.05,36.08 TEC-PINKY.1
N$27
  Top 0.254: HBRIDGE-PINKY.2 23.55,35.33 TEC-PINKY.2
N$30
  Top 0.254: VIBE-PALM.2 29.77,36.05 D10.A 30.2,34.1 30.36,33.94 Q6.3
N$34
  cutout Route15: 58.2,8 70.7,8 78.6,0 50.2,0
  cutout Route2: 62.2,12 66.6,12 78.6,0 50.2,0
N$35
  Top 0.152: MCU.56 54.8,16.55 | C34.1 53,16.7 53.15,16.55 54.8,16.55 | XTAL.3 54.55,16.8 54.8,16.55
N$36
  Top 0.152: MCU.57 56.8,16.05 | XTAL.1 57.05,15.8 56.8,16.05 | C33.1 53,15.9 53.15,16.05 56.8,16.05
N$37
  cutout Route2: 57.5,19 57.5,13.6 53.9,13.6 53.9,19
N$38
  Top 0.152: FLEX-INDEX.2 | R12.2 63.12,33.82 62.9,33.6 62.1,33.6 59.26,30.76 56.47,30.76 56.3,30.93 56.3,31.6 56.45,31.75 OPAMP1.3
  Top 0.254: R12.2 FLEX-INDEX.2
N$40  (via drill 0.25)
  Top 0.606: L1.1 v53.8,4.1
  Bottom 0.606: v53.8,4.1 50.39,0.69 20.71,0.69 20.1,1.3
  Bottom 0.61: BR_ANALOG.P$2 20.1,1.3
N$41
  Top 0.152: 72.32,36.29 FLEX-RING.2 | R14.2 72.32,33.92 72,33.6 67.89,33.6 65.09,30.8 62.3,30.8 62.1,31 62.1,31.6 62.25,31.75 OPAMP2.3
  Top 0.254: R14.2 72.32,36.29
N$45
  Top 0.254: MCU.9 64.65,10.95 65.13,10.17 BALUN1.3
N$46
  Top 0.254: MCU.8 64.15,10.95 63.67,10.17 BALUN1.4
N$47
  Top 0.254: BALUN1.2 65.7,9.4 66.2,9.9 C36.1
N$50
  Top 0.152: FTDI.DTR 74.87,10.21 74.3,9.64 C22.1
N$53
  Top 0.254: LED1.K R48.2
N$54
  Top 0.152: LED2.K R4.2
N$55
  Top 0.152: LED3.K R5.2
N$62
  Top 0.152: C32.1 71.1,14.5 71.05,14.55 | MCU.22 70.55,15.05 71.05,14.55 | 71.05,14.55 MCU.21
N$63
  Top 0.152: MCU.60 59.05,14.55 58.48,13.98 58.48,13.28 57.6,12.4 57.6,9.9 57.4,9.7 C31.1
N$991
  Top 0.152: 67.72,36.29 FLEX-MIDDLE.2 | OPAMP2.5 65.14,31.25 67.72,33.82 R13.2
  Top 0.254: R13.2 67.72,36.29
N$1004
  Top 0.152: FLEX-THUMB.2 | R11.2 58.52,33.68 58.6,33.6 60.2,33.6 60.58,33.22 60.58,32.48 59.34,31.25 OPAMP1.5
  Top 0.254: R11.2 FLEX-THUMB.2
N$10001
  Top 0.152: FLEX-PINKY.2 | R15.2 76.92,33.62 76.8,33.5 73.1,33.5 70.4,30.8 67.5,30.8 67.3,31 67.3,31.6 67.45,31.75 OPAMP3.3
  Top 0.254: R15.2 FLEX-PINKY.2
NGND  (via drill 0.25)
  Top 0.254: C60.2 23.81,33.34 HBRIDGE-PINKY.P$2 | C59.2 19.21,33.34 HBRIDGE-RING.P$2 | C58.2 14.61,33.34 HBRIDGE-MIDDLE.P$2 | C57.2 10.01,33.34 HBRIDGE-INDEX.P$2 | C56.2 5.41,33.34 HBRIDGE-THUMB.P$2 | HBRIDGE-THUMB.4 4.15,33.57 HBRIDGE-THUMB.P$1 HBRIDGE-THUMB.GND | HBRIDGE-INDEX.4 8.75,33.57 HBRIDGE-INDEX.P$1 HBRIDGE-INDEX.GND | HBRIDGE-MIDDLE.4 13.35,33.57 HBRIDGE-MIDDLE.P$1 HBRIDGE-MIDDLE.GND | HBRIDGE-RING.4 17.95,33.57 HBRIDGE-RING.P$1 HBRIDGE-RING.GND | HBRIDGE-PINKY.4 22.55,33.57 HBRIDGE-PINKY.P$1 HBRIDGE-PINKY.GND | R48.1 v37,9.4 | Q6.2 27.65,31.45 v27.6,31.5 | Q5.2 32.25,31.45 v32.2,31.5 | Q4.2 36.85,31.45 v36.8,31.5 | Q2.2 46.05,31.45 v46,31.5 | Q3.2 41.45,31.45 v41.4,31.5 | Q1.2 50.65,31.45 v50.6,31.5
  Top 0.508: v29.5,17.4 C18.K | v25.79,25.5 C21.K | v35.1,8.7 C7.2 | C6.2 v35.1,7.4 | v39,9.3 C1.K | C3.K v27.6,7.4 | v42.3,6.9 C5.2 | v41,6.9 C4.2 | VREG-VIBE.TAB v28.9,12.4 v30.3,12.4 VREG-VIBE.2 | v23.2,13.6 C8.2 | v23.2,14.9 C9.2 | v24.4,12.15 24.38,12.12 C2.K
  Top 1.016: 12.9,19.8 VREG-TEC.TAB v6.8,19.8 | VREG-TEC.3 v18.8,19.8 12.9,19.8 | v12.8,13.3 12.8,19.7 12.9,19.8 | v12.8,26.3 12.8,19.9 12.9,19.8
  Bottom 0.508: BR_NOISE.P$1 v16.8,6.7
  other vias: 30.3,11 30.3,13.8 27.5,9.9 27.5,14.9 28.9,14.9 30.3,14.9 31.7,14.9 28.9,9.9 30.3,9.9 31.7,9.9 31.7,11 31.7,12.4 31.7,13.8 28.9,13.8 28.9,11 18.8,18.2 18.8,16.6 18.8,15 14.3,13.3 15.8,13.3 17.3,13.3 18.8,13.3 18.8,21.5 18.8,23.1 18.8,24.7 14.3,26.3 15.8,26.3 17.3,26.3 18.8,26.3 6.8,18.2 6.8,16.6 6.8,15 6.8,13.3 6.8,21.5 6.8,23.1 6.8,24.7 6.8,26.3 9.8,26.3 8.3,26.3 11.3,26.3 11.3,13.3 9.8,13.3 8.3,13.3 26.1,9.9 26.1,14.9 21.3,33.2 22,33.2 25.9,33.2 26.6,33.2 17.4,33.2 16.7,33.2 12.8,33.2 12.1,33.2 8.2,33.2 7.5,33.2 3.5,33.2 2.8,33.2 2.3,13.3 2.3,15 2.3,16.6 2.3,18.2 2.3,19.8 2.3,21.5 2.3,23.1 0.8,23.1 0.8,24.7 0.8,26.3 2.3,24.7 2.3,26.3 0.8,13.3 0.8,15 0.8,16.6 0.8,18.2 0.8,19.8 0.8,21.5 5.3,13.3 3.8,13.3 5.3,15 3.8,15 5.3,16.6 3.8,16.6 5.3,18.2 3.8,18.2 3.8,19.8 5.3,19.8 5.3,21.5 3.8,21.5 3.8,23 3.8,24.7 3.8,26.3 5.3,23.1 5.3,26.3 5.3,24.7
  pour Route15: 0.1,28.21 32.8,28.1 32.8,8.9 0,8.9
  pour Top: 25.4,15.7 25.4,9.1 32,9.1 32,12.1 33.9,12.1 33.9,12.7 32,12.7 32,15.7
  pour Top: 0,27 19.9,27 19.9,20.2 22.8,20.2 22.8,19.4 19.9,19.4 19.9,12.6 0,12.6
  pour Bottom: 0,0 17.9,0 17.9,6.5 42.9,6.5 42.9,10.2 34.1,19 25.9,19 25.9,31 54.4,31 54.4,38.4 0,38.4
  pour Top (no thermals): 26.9,33.6 26.9,32.8 2.4,32.8 2.4,33.6
RESET  (via drill 0.25)
  Top 0.152: v70.5,10.5 71.27,10.5 D4.A 72.49,10.47 R1.1 72.62,10.56 C22.2 74.36,10.56 75.3,11.5 76.6,11.5 77.1,12 77.1,24.25 74.75,26.6 AVR_ISP.RESET | MCU.12 66.15,12.57 v66.3,12.72
  Bottom 0.152: v66.3,12.72 67.98,12.72 70.2,10.5 v70.5,10.5
RFSIG
  pour Top (no thermals): 64.1,6.9 64.1,7.7 65.3,8.9 66.6,8.9 66.6,8.5 65.6,8.5 64.6,7.5 64.6,6.9
RX0  (via drill 0.25)
  Top 0.152: MCU.46 61.65,21.95 v61.2,22.4
  Bottom 0.152: v61.2,22.4 61.7,22.9 63.81,22.9 66.15,20.56 68.91,20.56 71.19,18.28 73.32,18.28 75.8,15.8 FTDI.TXO
S0  (via drill 0.25)
  Top 0.152: MCU.29 70.33,18.55 v71.59,19.81 | DEMUX1.10 45.02,26.41 v45.3,26.14
  Bottom 0.152: v71.59,19.81 71.59,21 70.35,22.24 66.95,22.24 63.2,25.99 45.45,25.99 v45.3,26.14
S1  (via drill 0.25)
  Top 0.152: MCU.30 70,19.05 v71.13,20.17 | v44.7,26.05 44.38,26.38 DEMUX1.11
  Bottom 0.152: v71.13,20.17 71.13,21.06 70.23,21.96 66.83,21.96 63.08,25.71 45.04,25.71 v44.7,26.05
S2  (via drill 0.25)
  Top 0.152: MCU.32 69.35,20.05 v70.2,20.9 | v45,25 44.38,24.37 DEMUX1.14
  Bottom 0.152: v70.2,20.9 70.2,21 69.8,21.4 66.6,21.4 62.85,25.15 45.15,25.15 v45,25
S3  (via drill 0.25)
  Top 0.152: MCU.31 69.68,19.55 v70.66,20.54 | DEMUX1.13 43.73,24.56 v44.52,25.35
  Bottom 0.152: v70.66,20.54 70.66,21.13 70.12,21.68 66.72,21.68 62.97,25.43 44.59,25.43 v44.52,25.35
SCK
  Top 0.152: MCU.37 66.15,23.34 66.24,23.43 66.51,23.7 67.3,24.5 67.83,25.02 69.56,25.02 AVR_ISP.SCK
SCL  (via drill 0.25)
  Top 0.152: MCU.25 70.45,16.55 70.7,16.3 R2.1 71.02,16.72 71.25,16.95 73.05,16.95 73.1,17 | 73.1,17 73.33,17.23 73.33,17.77 72.25,18.85 v71.95,18.85 | PWM_DRIVER1.26 40.62,23.04 v41.95,24.36 | BR_CONNECTOR.2 74.57,4.43 69.6,9.4 69.6,10.9 70.3,11.6 73.9,11.6 74.3,12 74.3,15.8 73.1,17
  Bottom 0.152: v41.95,24.36 42.09,24.5 45.16,24.5 45.52,24.87 62.73,24.87 66.48,21.12 69.18,21.12 70.95,19.35 71.45,19.35 v71.95,18.85
SDA  (via drill 0.25)
  Top 0.152: v42.3,23.8 41.27,22.77 PWM_DRIVER1.27 | MCU.26 70.15,17.05 70.7,17.6 R3.1 71.02,18.63 v71.25,18.86 71.69,19.3 72.19,19.3 73.61,17.88 73.61,16.88 74.58,15.92 74.58,11.88 74.02,11.32 70.42,11.32 69.88,10.78 69.88,9.52 72.42,6.97 BR_CONNECTOR.1
  Bottom 0.152: v42.3,23.8 42.73,24.23 45.27,24.23 45.64,24.59 62.62,24.59 66.37,20.84 69.06,20.84 71.05,18.86 v71.25,18.86
SIG
  Top 0.254: DEMUX1.1 50.88,28.68 50.7,28.85 43.3,28.85 42.82,28.37 42.82,19.23 43.28,18.77 46.46,18.77 52.43,12.79 54.11,12.79 54.4,12.5 54.4,9.4 54.8,9 57.4,9 58.8,10.4 58.8,12.26 59.59,13.05 MCU.63
TEC-INDEX-COLD
  Top 0.152: PWM_DRIVER1.17 34.77,22.27 33.79,23.26 33.52,23.26 31.58,25.2 31.58,26.75 31.07,27.27 28.26,27.27 27.98,27.54 24.59,27.54 24.31,27.82 22.3,27.82 22.02,28.1 20.22,28.1 19.94,28.38 17.93,28.38 17.65,28.66 15.85,28.66 15.57,28.94 13.56,28.94 13.28,29.22 11.48,29.22 11.2,29.5 9.2,29.5 9,29.7 9,30.8 8.82,30.98 R41.2 8.35,31.35 8.75,31.75 HBRIDGE-INDEX.5
TEC-INDEX-HOT
  Top 0.152: PWM_DRIVER1.18 35.42,22.29 34.18,23.54 33.64,23.54 31.86,25.32 31.86,26.87 31.19,27.54 28.38,27.54 28.1,27.82 24.71,27.82 24.43,28.1 22.41,28.1 22.13,28.38 20.34,28.38 20.06,28.66 18.04,28.66 17.76,28.94 15.97,28.94 15.69,29.22 13.68,29.22 13.4,29.5 11.6,29.5 10.12,30.98 R40.2 9.65,31.35 9.25,31.75 HBRIDGE-INDEX.6
TEC-MIDDLE-COLD
  Top 0.152: PWM_DRIVER1.19 36.08,22.29 34.54,23.82 33.75,23.82 32.14,25.43 32.14,26.98 31.3,27.82 28.5,27.82 28.22,28.1 24.82,28.1 24.54,28.38 22.53,28.38 22.25,28.66 20.45,28.66 20.17,28.94 18.16,28.94 17.88,29.22 16.08,29.22 15.8,29.5 13.8,29.5 13.6,29.7 13.6,30.8 13.42,30.98 R43.2 12.95,31.35 13.35,31.75 HBRIDGE-MIDDLE.5
TEC-MIDDLE-HOT
  Top 0.152: PWM_DRIVER1.20 36.73,22.29 34.91,24.1 33.87,24.1 32.42,25.55 32.42,27.1 31.42,28.1 28.61,28.1 28.33,28.38 24.94,28.38 24.66,28.66 22.64,28.66 22.36,28.94 20.57,28.94 20.29,29.22 18.27,29.22 17.99,29.5 16.2,29.5 14.73,30.97 14.73,30.98 R42.2 14.25,31.35 13.85,31.75 HBRIDGE-MIDDLE.6
TEC-PINKY-COLD
  Top 0.152: HBRIDGE-PINKY.5 22.55,31.75 22.15,31.35 R47.2 22.62,30.98 22.8,30.8 22.8,29.69 22.99,29.5 25.01,29.5 25.28,29.22 28.69,29.22 28.97,28.94 33.49,28.94 34.12,28.31 PWM_DRIVER1.13
TEC-PINKY-HOT
  Top 0.152: PWM_DRIVER1.12 34.77,28.73 34.57,28.94 33.89,28.94 33.61,29.22 29.08,29.22 28.8,29.5 25.4,29.5 23.92,30.98 R46.2 23.45,31.35 23.05,31.75 HBRIDGE-PINKY.6
TEC-RING-COLD
  Top 0.152: PWM_DRIVER1.21 37.38,22.28 35.27,24.38 33.98,24.38 32.7,25.66 32.7,27.22 31.53,28.38 28.73,28.38 28.72,28.39 28.45,28.66 25.05,28.66 24.77,28.94 22.76,28.94 22.48,29.22 20.68,29.22 20.41,29.5 18.39,29.5 18.2,29.69 18.2,30.8 18.02,30.98 R45.2 17.55,31.35 17.95,31.75 HBRIDGE-RING.5
TEC-RING-HOT
  Top 0.152: PWM_DRIVER1.22 38.02,22.27 35.64,24.66 34.1,24.66 32.98,25.78 32.98,27.33 31.65,28.66 28.85,28.66 28.57,28.94 25.17,28.94 24.89,29.22 22.87,29.22 22.59,29.5 20.8,29.5 19.32,30.98 R44.2 18.85,31.35 18.45,31.75 HBRIDGE-RING.6
TEC-THUMB-COLD
  Top 0.152: HBRIDGE-THUMB.5 4.15,31.75 3.75,31.35 R39.2 4.22,30.98 4.4,30.8 4.4,29.7 4.6,29.5 6.6,29.5 6.88,29.22 8.69,29.22 8.97,28.94 10.97,28.94 11.25,28.66 13.05,28.66 13.33,28.38 15.34,28.38 15.62,28.1 17.42,28.1 17.7,27.82 19.71,27.82 19.99,27.54 21.78,27.54 22.06,27.27 24.08,27.27 24.36,26.98 27.75,26.98 28.03,26.71 30.84,26.71 31.02,26.52 31.02,24.97 33.48,22.52 PWM_DRIVER1.15
TEC-THUMB-HOT
  Top 0.152: PWM_DRIVER1.16 34.12,22.26 31.3,25.09 31.3,26.64 30.96,26.98 28.15,26.98 27.87,27.27 24.47,27.27 24.2,27.54 22.18,27.54 21.9,27.82 20.11,27.82 19.83,28.1 17.81,28.1 17.53,28.38 15.74,28.38 15.46,28.66 13.45,28.66 13.17,28.94 11.37,28.94 11.09,29.22 9.08,29.22 8.8,29.5 7,29.5 5.52,30.98 R38.2 5.05,31.35 4.65,31.75 HBRIDGE-THUMB.6
TX0  (via drill 0.25)
  Top 0.152: MCU.47 61.15,21.62 v60.84,21.94
  Bottom 0.152: FTDI.RXI 74.32,14.22 74.32,16.88 73.2,18 71.07,18 68.79,20.28 66.04,20.28 64,22.32 63.03,22.32 62.65,21.94 v60.84,21.94
VBAT  (via drill 0.25)
  Top 0.152: 44.1,5.24 VREG-MCU.3 | C7.1 33.42,8.72 | C2.A 21.54,11.02 | C9.1 21.61,15.27 | 24.19,18.1 D3.K
  Top 0.406: VREG-VIBE.1 35.69,10.1 35.9,10.31 D2.K
  Top 0.508: C7.1 C6.1 C3.A | 33.42,8.72 VREG-VIBE.1 | 21.54,11.02 C8.1 C9.1 | 21.61,15.27 VREG-TEC.1 VREG-TEC.2 24.19,18.1 | C2.A v20.4,10.6 | VREG-MCU.4 44.1,4.02 44.1,5.24 C5.1 C4.1 40.98,5.22 C1.A
  Top 1.27: BL_CONNECTOR.1 2.8,6.97 5.1,9.27 SW1.S1
  other vias: 20.4,9.6 20.4,11.6 19.7,10.1 19.7,11.1 31.7,4 32.7,5 33.7,4 34.7,5 35.7,4 37.7,4 39,4
  pour Route2: 40.3,11.4 40.3,0 0,0 0,23.8 26.2,23.8 26.2,11.4
  pour Top: 19.4,12 19.4,9.2 22.1,9.2 22.1,12
  pour Top: 31.2,8.6 31.2,3.5 40.3,3.5 40.3,5.9 32.4,5.9 32.4,8.6
VCC  (via drill 0.25)
  Top 0.254: PWM_DRIVER1.28 41.92,19.67 C50.1 41.9,19.56 v41.9,18.7 | HBRIDGE-PINKY.7 HBRIDGE-PINKY.8 C55.1 v25.94,32.16 v25.95,32.15 | HBRIDGE-RING.7 HBRIDGE-RING.8 20.41,32.16 C54.1 20.78,32.2 v21.35,32.2 | HBRIDGE-THUMB.7 HBRIDGE-THUMB.8 C51.1 v7.54,32.16 v7.55,32.15 | HBRIDGE-INDEX.7 HBRIDGE-INDEX.8 C52.1 v12.14,32.16 v12.15,32.15 | HBRIDGE-MIDDLE.7 HBRIDGE-MIDDLE.8 15.81,32.16 C53.1 16.18,32.2 v16.75,32.2 | MCU.23 71.15,15.55 72.4,14.3 C25.1 C26.1 v73.7,14.7 | v72.9,16.3 R2.2 | MCU.44 62.65,22.99 C23.1 62.66,23.84 v62.5,24 | MCU.34 67.65,22.79 C24.1 67.64,23.86 v67.6,23.9 | MCU.54 59.15,17.55 58.8,17.9 58.8,19.5 58.46,19.84 C27.1 C28.1 55.24,19.84 v55.2,19.8 | VREG-ANALOG.3 48.84,13.56 C13.1 C12.1 45.11,13.53 L2.1 v43.6,14.5 | R3.2 72.87,17.6 v72.9,17.57 | D4.K v71.3,8.8 | R1.2 72.6,8.9 v72.7,8.8
  Top 0.508: v53.1,5.2 53.06,5.24 C11.1 C10.1 49.1,5.24 VREG-MCU.6 VREG-MCU.5
  pour Route2 (rank 6): 0,38.44 0,0 80,0 80,38.44
VIBE-INDEX
  Top 0.152: PWM_DRIVER1.9 36.73,28.21 37.7,29.18 37.7,29.9 37.9,30.1 R35.2 38.22,32.58 38.05,32.75 Q4.1
VIBE-MIDDLE
  Top 0.152: PWM_DRIVER1.8 37.38,28.46 38.41,29.5 41.9,29.5 42.5,30.1 R34.2 42.82,32.58 42.65,32.75 Q3.1
VIBE-PALM
  Top 0.152: PWM_DRIVER1.11 35.42,28.48 34.68,29.22 34,29.22 33.72,29.5 29.2,29.5 29.02,29.68 R37.2 29,30.12 29,32.6 28.85,32.75 Q6.1
VIBE-PINKY
  Top 0.152: Q1.1 51.85,32.75 52.02,32.58 R32.2 51.7,30.1 51.1,29.5 46.89,29.5 46.62,29.22 42.41,29.22 42.13,28.94 38.84,28.94 38.67,28.77 PWM_DRIVER1.6
VIBE-RING
  Top 0.152: PWM_DRIVER1.7 38.02,28.72 38.52,29.22 42.02,29.22 42.3,29.5 46.5,29.5 47.1,30.1 R33.2 47.42,32.58 47.25,32.75 Q2.1
VIBE-THUMB
  Top 0.152: Q5.1 33.45,32.75 33.62,32.58 R36.2 33.62,30 34.12,29.5 34.8,29.5 36.08,28.23 PWM_DRIVER1.10
VSENSOR  (via drill 0.25)
  Top 0.254: C48.1 75.66,36.28 FLEX-PINKY.1 | C47.1 71.06,36.28 FLEX-RING.1 | C46.1 66.46,36.28 FLEX-MIDDLE.1 | C45.1 61.86,36.28 FLEX-INDEX.1 | C44.1 57.26,36.28 FLEX-THUMB.1 | OPAMP3.8 70.65,32.75 v70.8,32.9 | OPAMP2.8 65.55,32.75 v65.6,32.8 | OPAMP1.8 59.75,32.75 v59.8,32.8
  Top 0.381: C38.1 50.86,17.64
  Top 0.406: DEMUX1.24 50.88,18.57 C38.1 | 50.86,17.64 v50.9,17.6 | FLEX-THUMB.1 57.27,36.9 57.58,37.2 62.2,37.2 | 76,37.2 77.8,37.2 79.22,35.78 79.22,33.92 78.7,33.4 78,33.4 76,31.4 76,26.2 77.8,24.4 77.8,8.7 77.3,8.2 v73.4,8.2 | 76,37.2 71.4,37.2 | 71.4,37.2 66.8,37.2 | 66.8,37.2 62.2,37.2 | FLEX-INDEX.1 61.88,36.88 62.2,37.2 | FLEX-MIDDLE.1 66.47,36.88 66.8,37.2 | FLEX-RING.1 71.08,36.88 71.4,37.2 | FLEX-PINKY.1 75.67,36.88 76,37.2
  Route2 0.254: v70.8,32.9 71.08,33.17 FLEX-RING.1 | v65.6,32.8 66.47,33.67 FLEX-MIDDLE.1 | FLEX-INDEX.1 61.88,34.88 v59.8,32.8
  Route2 0.406: v53.5,10.3 54.8,9 58.6,9 61.6,12 61.6,18.7 61.9,19 66.9,19 67.2,18.7 67.2,12 71,8.2 v73.4,8.2
  Bottom 0.406: v53.5,10.3 JP1.2 51.5,10.3 50.9,10.9 v50.9,17.6

## Text on the board
tPlace: Transmission of Touch VR | Touch Glove Rev 3
bPlace: Designed by: | MrSwirlyEyes | Transmission of Touch VR | Touch Glove Rev 3